# EAGLE design LIC_Rack_BB-00_ext (EAGLE 7.2.0)
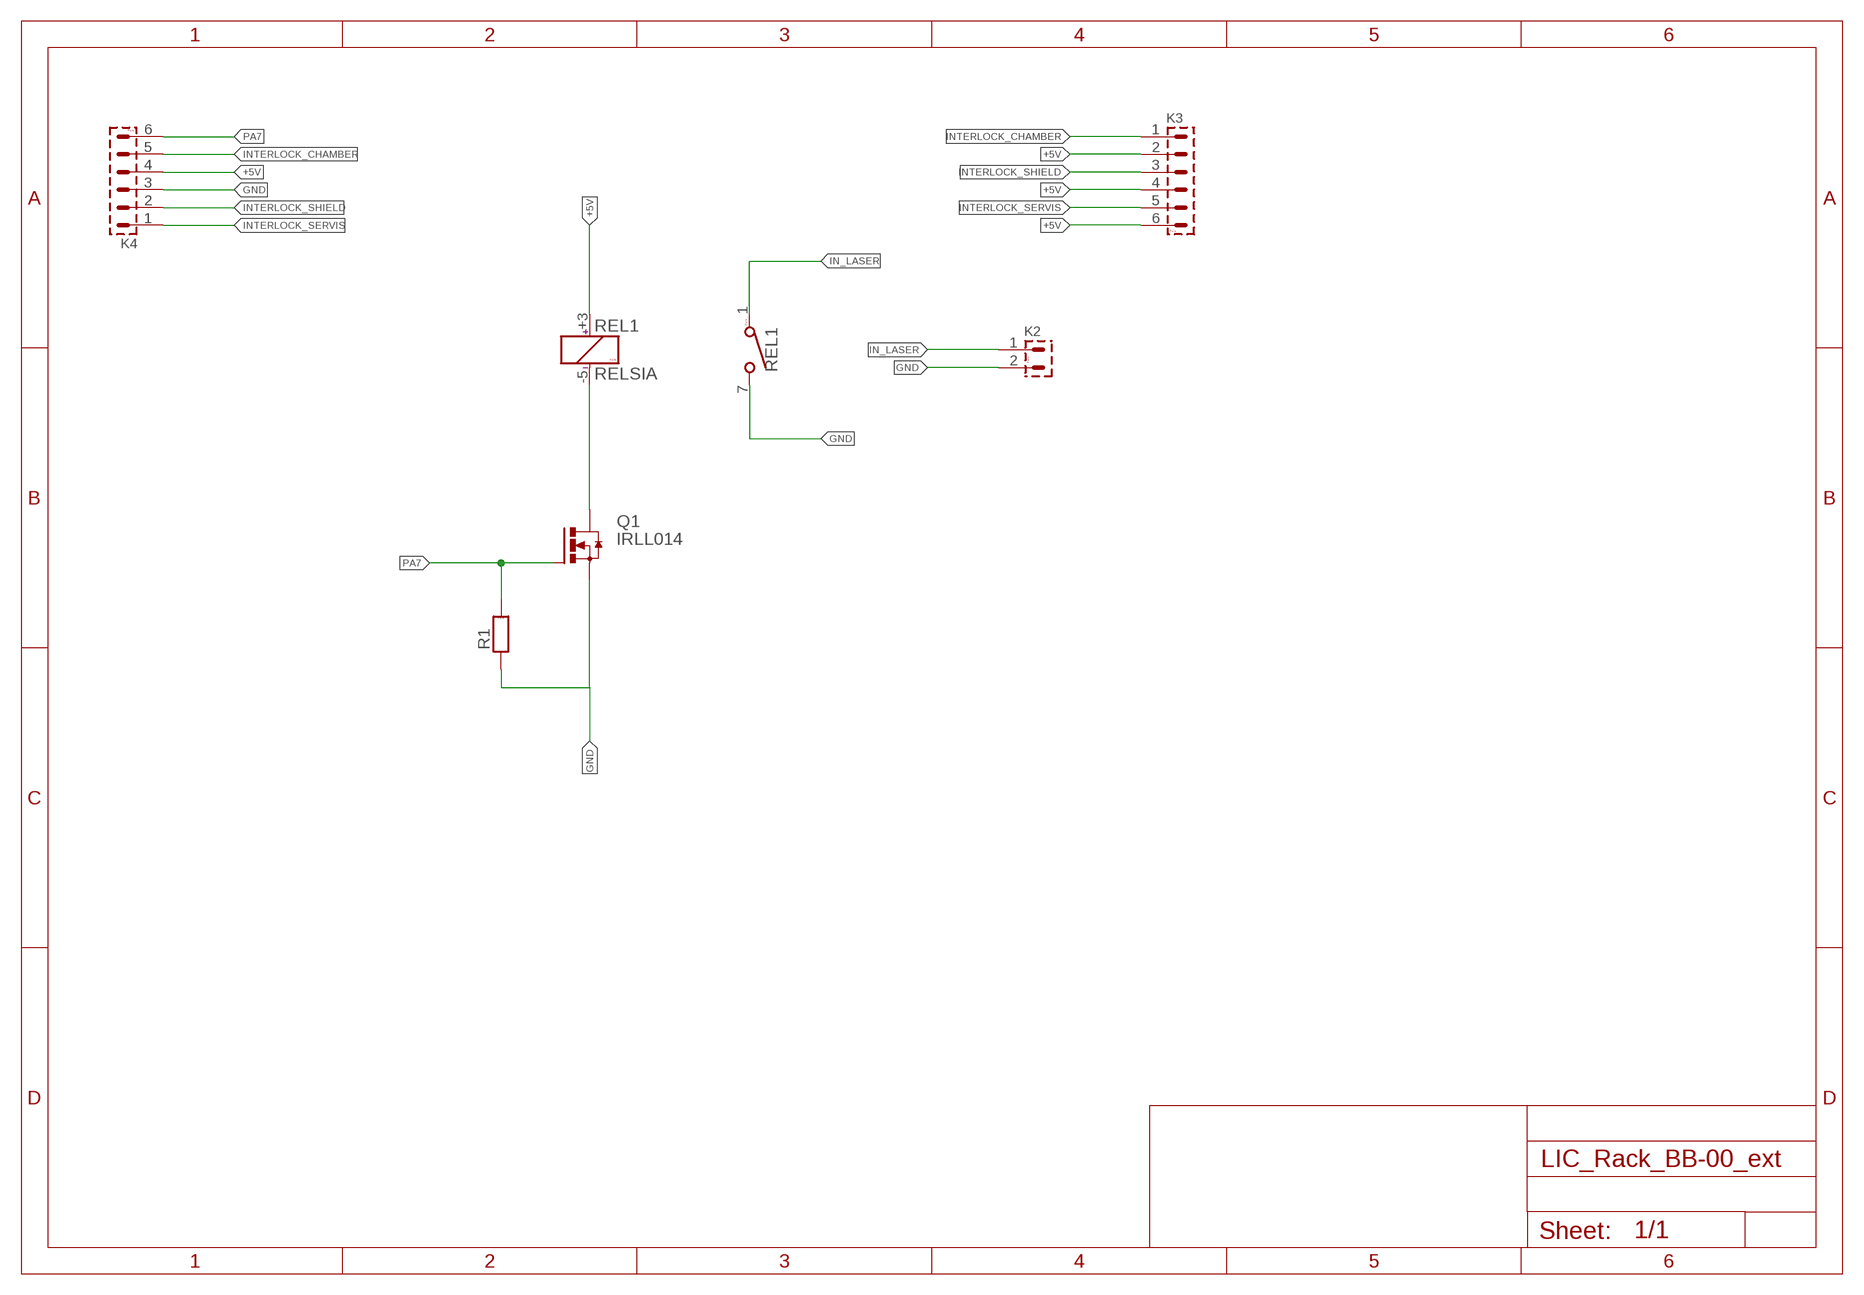
[diagram p0: schematic, sheet 1]

## Parts
K2  PSH02-02W  [PSH02-02W]
K3  PSH02-06W  [PSH02-06W]
K4  PSH02-06W  [PSH02-06W]
Q1  IRLL014  N-HEXFET-2D_SOT232-  [SOT223]
R1  R_1206  [1206]
REL1  RELSIA  [RELSIA]

## Nets
+5V: K3.2 K3.4 K3.6 K4.4 REL1.+3(CIVKA:C+)
GND: K2.2 K4.3 Q1.3(S) R1.1 REL1.7
IN_LASER: K2.1 REL1.1
INTERLOCK_CHAMBER: K3.1 K4.5
INTERLOCK_SERVIS: K3.5 K4.1
INTERLOCK_SHIELD: K3.3 K4.2
N$3: Q1.2(D) Q1.4(D) REL1.-5(CIVKA:C-)
PA7: K4.6 Q1.1(G) R1.2

## Library data of the parts
K2 = #PaJa_konektory:PSH02-02: Konektory se zamkem - vidlice - 2pin
K3 K4 = #PaJa_konektory:PSH02-06: Konektory se zamkem - vidlice - 6pin
Q1 = transistor-power:N-HEXFET-2D_?-*: HEXFET® Power MOSFET 2 Drain connects http://www.irf.com/product-info/datasheets/data/irll014n.pdf
R1 = #PaJa_31:R: Rezistor
REL1 = #PaJa_31:RELSIA??: RELE - 1x spinaci, 5V, 12V, 24V max. spinany proud = 0,5A

## Board
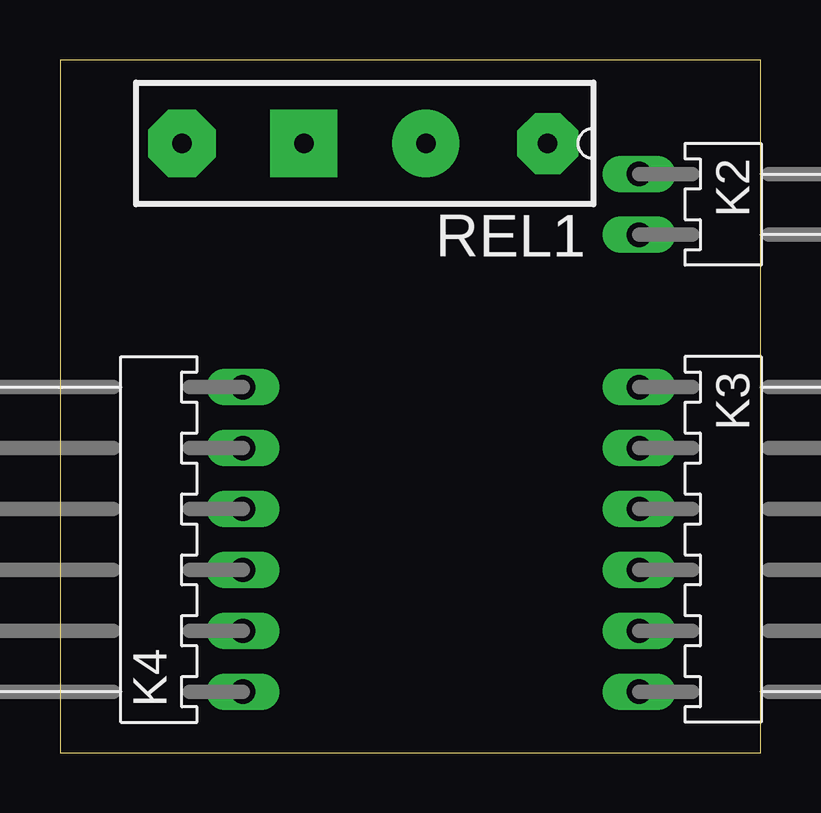
[diagram p1: board, top side]
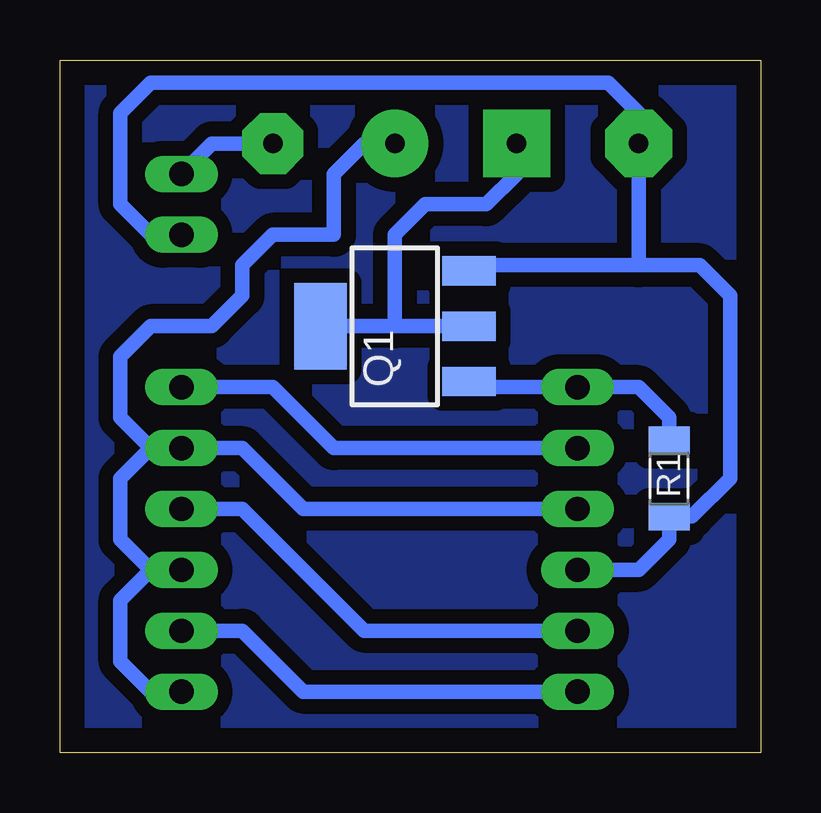
[diagram p2: board, bottom side, seen from below]

Size 29.19 x 28.88 mm. Coordinates in mm from the lower left corner, seen from the top.
Outline: 0,0 29.19,0 29.19,28.88 0,28.88 0,0
Copper layers (1*16): Top 0.035mm / dielectric 1.5mm / Bottom 0.035mm
Design rules "default": minimum track width 10mil, minimum drill 24mil, track to track 8mil, track to pad 8mil, pad to pad 8mil, via to via 8mil, smd to smd 8mil, copper to edge 40mil, drill to drill 8mil, minimum pad ring 10mil, minimum via ring 8mil, stop-mask expansion 4mil, vias tented up to drill 0mil, thermal gap 10mil

### Footprints (pad centres in the part's own frame; a part is rotated, then mirrored left to right if it is on the bottom)
PSH02-02W = drill 1.016 pad 1.422 long: 1 -1.27,0; 2 1.27,0
PSH02-06W = drill 1.016 pad 1.422 long: 1 -6.35,0; 2 -3.81,0; 3 -1.27,0; 4 1.27,0; 5 3.81,0; 6 6.35,0
SOT223 = smd 1.219 x 2.235: 1 -2.311,-3.099; 2 0,-3.099; 3 2.311,-3.099 | smd 3.6 x 2.2: 4 0,3.099
1206 = smd 1.143 x 1.702: 1 -1.587,0; 2 1.587,0
RELSIA = drill 0.813 pad 2.54 octagon: 1 -7.62,0 | drill 0.813 pad 2.8 octagon: 7 7.62,0 | drill 0.813 pad 2.8: +3 -2.54,0 | drill 0.813 pad 2.8 square: -5 2.54,0

### Placement (x,y rotation side)
K2  24.13,22.86 270 top
K3  24.13,8.89 270 top
K4  7.62,8.89 90 top
Q1  15.24,17.78 90 bottom
R1  3.81,11.43 90 bottom
REL1  RELSIA?  [RELSIA]  12.7,25.4 180 top

### Tracks (layer width: path | path; a pad name or v marks a point on that pad's centre or on a via)
+5V
  Bottom 0.61: REL1.+3 16.51,25.4 17.78,24.13 17.78,21.59 20.32,21.59 21.59,20.32 21.59,19.05 22.86,17.78 25.4,17.78 26.67,16.51 26.67,13.97 25.4,12.7 | 25.4,12.7 K3.2 21.59,12.7 19.05,10.16 K4.4 | 25.4,12.7 26.67,11.43 26.67,8.89 25.4,7.62 | 25.4,7.62 K3.4 | K3.6 25.4,2.54 26.67,3.81 26.67,6.35 25.4,7.62
GND
  Bottom 0.61: K4.3 5.08,7.62 3.81,8.89 R1.1 2.86,9.84 1.27,11.43 1.27,19.05 2.54,20.32 5.08,20.32 | 5.08,20.32 11.91,20.32 Q1.3 | 5.08,20.32 REL1.7 5.08,26.67 6.35,27.94 25.4,27.94 26.67,26.67 26.67,22.86 25.4,21.59 K2.2
IN_LASER
  Bottom 0.61: REL1.1 22.86,25.4 K2.1
INTERLOCK_CHAMBER
  Bottom 0.61: K4.5 17.78,12.7 20.32,15.24 K3.1
INTERLOCK_SERVIS
  Bottom 0.61: K3.5 21.59,5.08 19.05,2.54 K4.1
INTERLOCK_SHIELD
  Bottom 0.61: K3.3 21.59,10.16 16.51,5.08 K4.2
N$1
  pour Bottom (isolate 0.61): 0,0 29.21,0 29.21,29.21 0,29.21
N$3
  Bottom 0.61: REL1.-5 10.16,24.13 11.43,22.86 13.97,22.86 15.24,21.59 15.24,17.78 | 15.24,17.78 Q1.4 | Q1.2 15.24,17.78
PA7
  Bottom 0.61: R1.2 3.81,13.97 5.08,15.24 K4.6 11.91,15.24 Q1.1